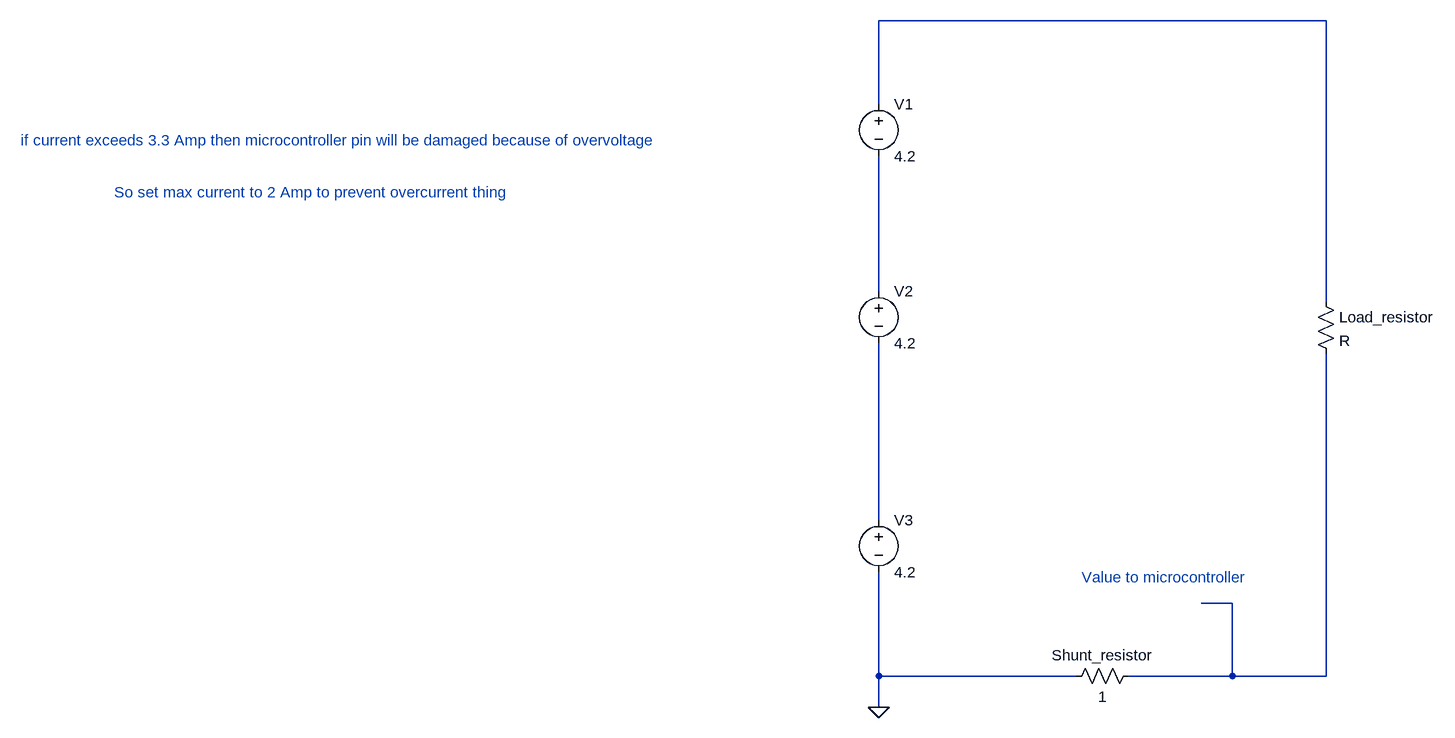
[diagram p0: schematic Using shunt resistor.asc]
Using shunt resistor.asc, the LTspice schematic file:
Version 4
SHEET 1 1068 964
WIRE 880 -112 192 -112
WIRE 192 16 192 -112
WIRE 192 304 192 96
WIRE 880 320 880 -112
WIRE 192 656 192 384
WIRE 736 784 688 784
WIRE 192 896 192 736
WIRE 496 896 192 896
WIRE 736 896 736 784
WIRE 736 896 576 896
WIRE 880 896 880 400
WIRE 880 896 736 896
WIRE 192 944 192 896
FLAG 192 944 0
SYMBOL voltage 192 0 R0
WINDOW 123 0 0 Left 0
WINDOW 39 0 0 Left 0
SYMATTR InstName V1
SYMATTR Value 4.2
SYMBOL voltage 192 288 R0
WINDOW 123 0 0 Left 0
WINDOW 39 0 0 Left 0
SYMATTR InstName V2
SYMATTR Value 4.2
SYMBOL voltage 192 640 R0
WINDOW 123 0 0 Left 0
WINDOW 39 0 0 Left 0
SYMATTR InstName V3
SYMATTR Value 4.2
SYMBOL res 592 880 R90
WINDOW 0 0 56 VBottom 2
WINDOW 3 32 56 VTop 2
SYMATTR InstName Shunt_resistor
SYMATTR Value 1
SYMBOL res 864 304 R0
SYMATTR InstName Load_resistor
TEXT 504 744 Left 2 ;Value to microcontroller
TEXT -1128 72 Left 2 ;if current exceeds 3.3 Amp then microcontroller pin will be damaged because of overvoltage
TEXT -984 152 Left 2 ;So set max current to 2 Amp to prevent overcurrent thing

The netlist it stands for:
* Using shunt resistor.asc
V1 N001 N002 4.2
V2 N002 N003 4.2
V3 N003 0 4.2
R§Shunt_resistor N004 0 1
R§Load_resistor N001 N004 R
* Value to microcontroller
* if current exceeds 3.3 Amp then microcontroller pin will be damaged because of overvoltage
* So set max current to 2 Amp to prevent overcurrent thing
.backanno
.end